# EAGLE design Board LineFollower V.2 (EAGLE 5.06)
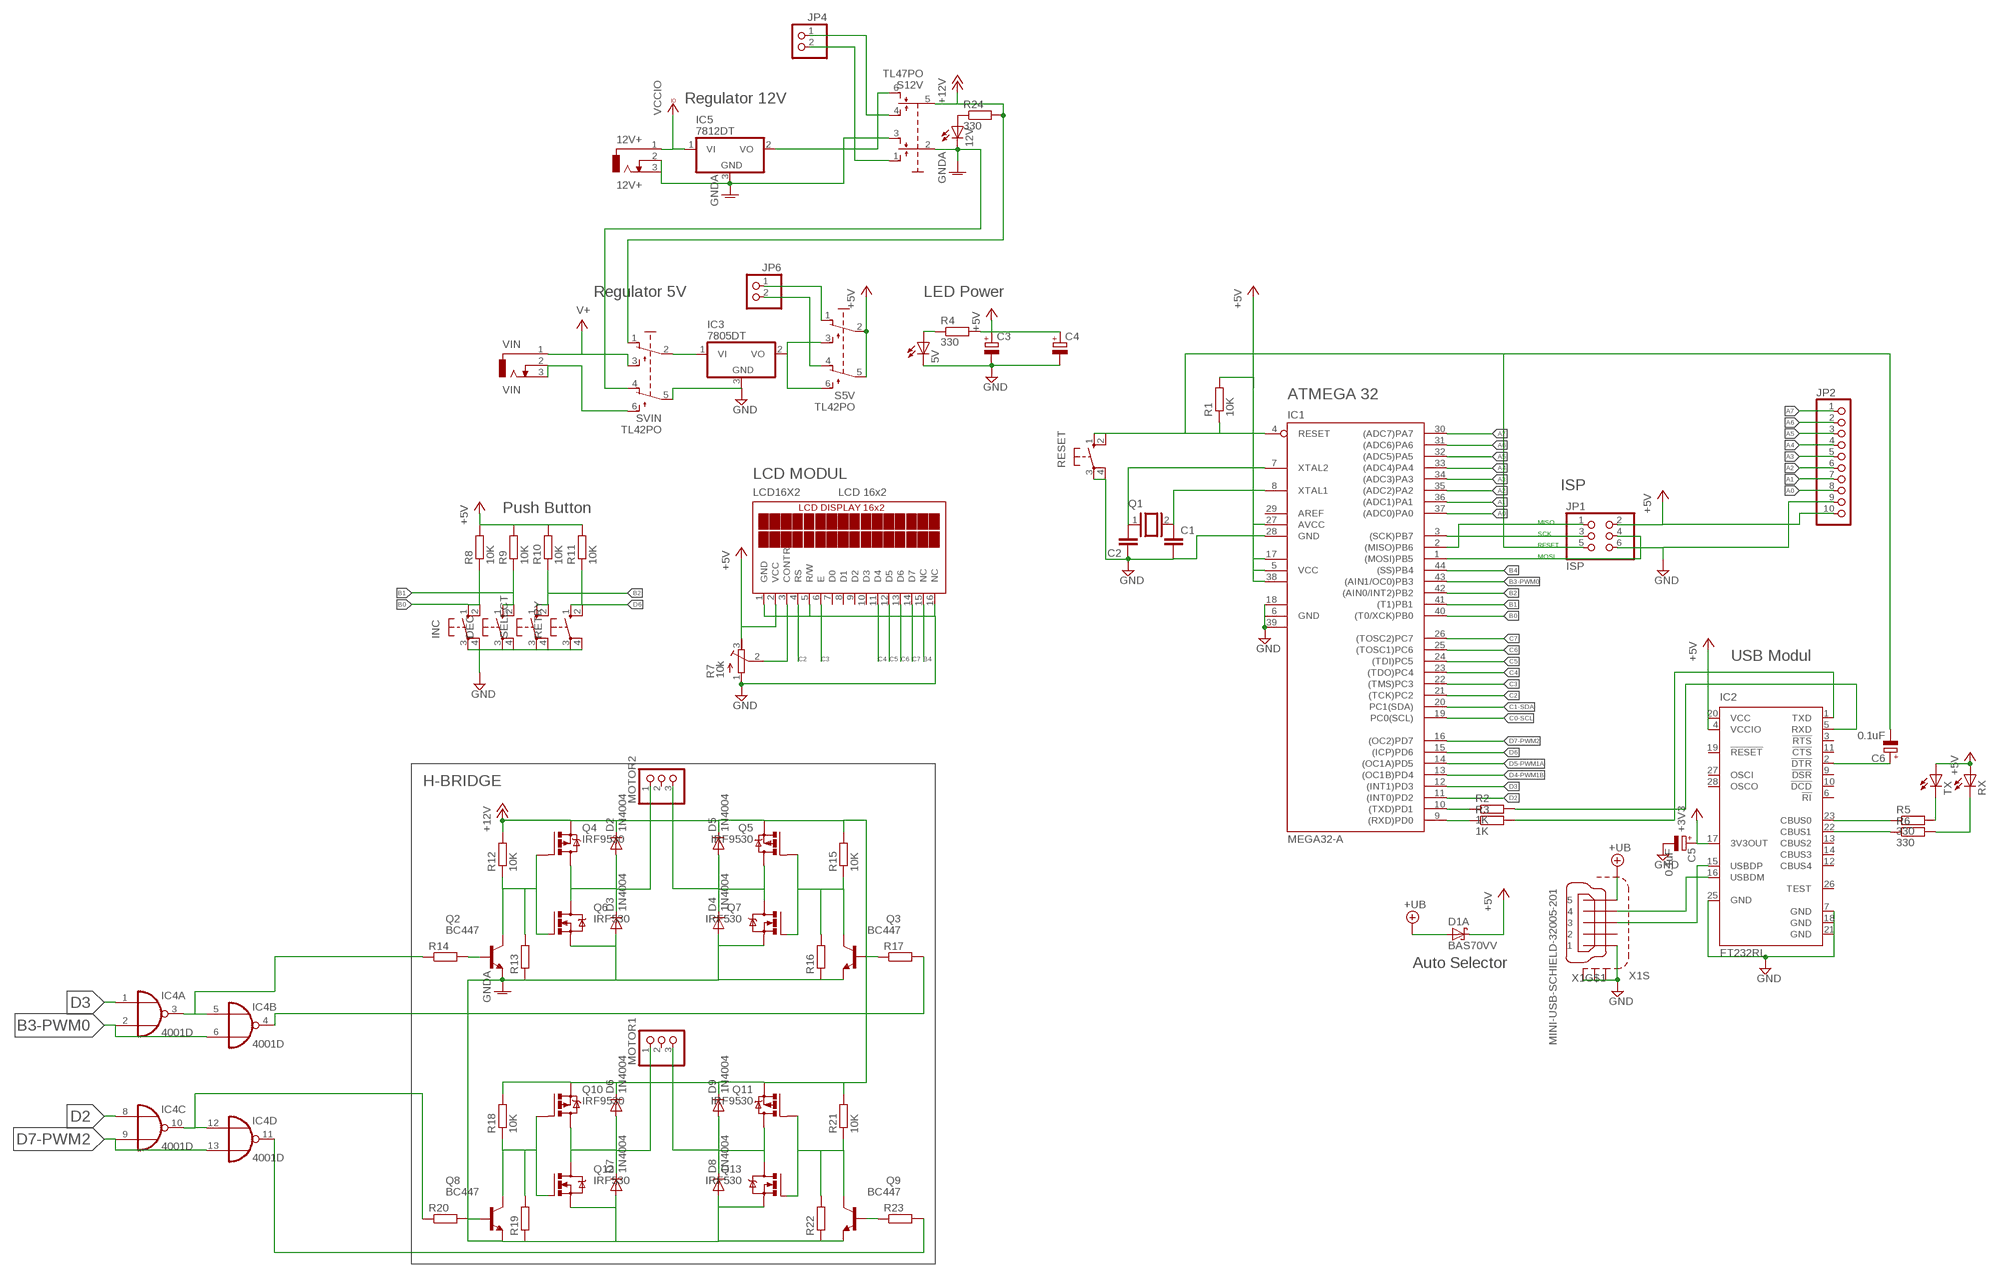
[diagram p0: schematic, sheet 1]

## Parts
5V  LED5MM  [LED5MM]
12V  LED5MM  [LED5MM]
12V+  12V+  DCJ0202  [DCJ0202]
C1  C-EU050-025X075  [C050-025X075]
C2  C-EU050-025X075  [C050-025X075]
C3  CPOL-EUE3.5-8  [E3,5-8]
C4  CPOL-EUE3.5-8  [E3,5-8]
C5  0.1uF  CPOL-EUE2-4  [E2-4]
C6  0.1uF  CPOL-EUE2-4  [E2-4]
D1  BAS70VV  [SOT666]
D2  1N4004  [DO41-10]
D3  1N4004  [DO41-10]
D4  1N4004  [DO41-10]
D5  1N4004  [DO41-10]
D6  1N4004  [DO41-10]
D7  1N4004  [DO41-10]
D8  1N4004  [DO41-10]
D9  1N4004  [DO41-10]
DEC  10-XX  [B3F-10XX]
IC1  MEGA32-A  [TQFP44]
IC2  FT232RL  [SSOP28]
IC3  7805DT  [TO252]
IC4  4001D  [SO14]
IC5  7812DT  [TO252]
INC  10-XX  [B3F-10XX]
JP1  ISP  PINHD-2X3  [2X03]
JP2  PINHD-1X10  [1X10]
JP4  PINHD-1X2  [1X02]
JP6  PINHD-1X2  [1X02]
LCD16X2  LCD 16x2  TUXGR_16X2_R2  [TUXGR_16X2_R2]
MOTOR1  PINHD-1X3  [1X03]
MOTOR2  PINHD-1X3  [1X03]
Q1  XTAL/S  [QS]
Q2  BC447  [TO92-EBC]
Q3  BC447  [TO92-EBC]
Q4  IRF9530  [TO220BV]
Q5  IRF9530  [TO220BV]
Q6  IRF530  [TO220BV]
Q7  IRF530  [TO220BV]
Q8  BC447  [TO92-EBC]
Q9  BC447  [TO92-EBC]
Q10  IRF9530  [TO220BV]
Q11  IRF9530  [TO220BV]
Q12  IRF530  [TO220BV]
Q13  IRF530  [TO220BV]
R1  10K  R-EU_0207/7  [0207/7]
R2  1K  R-EU_0207/7  [0207/7]
R3  1K  R-EU_0207/7  [0207/7]
R4  330  R-EU_0207/7  [0207/7]
R5  330  R-EU_0207/7  [0207/7]
R6  330  R-EU_0207/7  [0207/7]
R7  10k  R-TRIMM3339P  [RTRIM3339P]
R8  10K  R-EU_0207/7  [0207/7]
R9  10K  R-EU_0207/7  [0207/7]
R10  10K  R-EU_0207/7  [0207/7]
R11  10K  R-EU_0207/7  [0207/7]
R12  10K  R-EU_0207/7  [0207/7]
R13  R-EU_0207/7  [0207/7]
R14  R-EU_0207/7  [0207/7]
R15  10K  R-EU_0207/7  [0207/7]
R16  R-EU_0207/7  [0207/7]
R17  R-EU_0207/7  [0207/7]
R18  10K  R-EU_0207/7  [0207/7]
R19  R-EU_0207/7  [0207/7]
R20  R-EU_0207/7  [0207/7]
R21  10K  R-EU_0207/7  [0207/7]
R22  R-EU_0207/7  [0207/7]
R23  R-EU_0207/7  [0207/7]
R24  330  R-EU_0207/7  [0207/7]
RESET  10-XX  [B3F-10XX]
RETRY  10-XX  [B3F-10XX]
RX  LED5MM  [LED5MM]
S5V  TL42PO  [TL4XPO]
S12V  TL47PO  [TL4XPO]
SELECT  10-XX  [B3F-10XX]
SVIN  TL42PO  [TL4XPO]
TX  LED5MM  [LED5MM]
VIN  VIN  DCJ0202  [DCJ0202]
X1  MINI-USB-SCHIELD-32005-201  [32005-201]

## Nets
+3V3: C5.+ IC2.17(3V3OUT)
+5V: C3.+ C4.+ D1.6(A:C) IC1.5(VCC) IC1.17(VCC1) IC1.27(AVCC) IC1.38(VCC2) IC2.4(VCCIO) IC2.20(VCC) JP1.2 JP2.10 LCD16X2.2(VCC) R1.2 R4.2 R7.3(A) R8.2 R9.2 R10.2 R11.2 RX.A S5V.2(P) S5V.5(P1) TX.A
+12V: D2.C D5.C D6.C D9.C Q4.S Q5.S Q10.S Q11.S R12.2 R15.2 R18.2 R21.2 R24.2 S12V.5(P1) SVIN.1(O)
+UB: D1.1(A:A)
+USB: X1.5 ; supply symbol labelled +UB
A0: IC1.37((ADC0)PA0) JP2.8
A1: IC1.36((ADC1)PA1) JP2.7
A2: IC1.35((ADC2)PA2) JP2.6
A3: IC1.34((ADC3)PA3) JP2.5
A4: IC1.33((ADC4)PA4) JP2.4
A5: IC1.32((ADC5)PA5) JP2.3
A6: IC1.31((ADC6)PA6) JP2.2
A7: IC1.30((ADC7)PA7) JP2.1
B0: IC1.40((T0/XCK)PB0) INC.1(S) INC.2(S1) R8.1
B1: DEC.1(S) DEC.2(S1) IC1.41((T1)PB1) R9.1
B2: IC1.42((AIN0/INT2)PB2) R10.1 SELECT.1(S) SELECT.2(S1)
B3-PWM0: IC1.43((AIN1/OC0)PB3) IC4.2(A:I1) IC4.6(B:I1)
B4: IC1.44((SS)PB4) LCD16X2.15(NC)
B5-MOSI: IC1.1((MOSI)PB5) JP1.4
B6-MISO: IC1.2((MISO)PB6) JP1.1
B7-SCK: IC1.3((SCK)PB7) JP1.3
C0-SCL: IC1.19(PC0(SCL))
C1-SDA: IC1.20(PC1(SDA))
C2: IC1.21((TCK)PC2) LCD16X2.4(RS)
C3: IC1.22((TMS)PC3) LCD16X2.6(E)
C4: IC1.23((TDO)PC4) LCD16X2.11(D4)
C5: IC1.24((TDI)PC5) LCD16X2.12(D5)
C6: IC1.25((TOSC1)PC6) LCD16X2.13(D6)
C7: IC1.26((TOSC2)PC7) LCD16X2.14(D7)
D0-RX: IC1.9((RXD)PD0) R3.1
D1-TX: IC1.10((TXD)PD1) R2.1
D2: IC1.11((INT0)PD2) IC4.8(C:I0)
D3: IC1.12((INT1)PD3) IC4.1(A:I0)
D4-PWM1B: IC1.13((OC1B)PD4)
D5-PWM1A: IC1.14((OC1A)PD5)
D6: IC1.15((ICP)PD6) R11.1 RETRY.1(S) RETRY.2(S1)
D7-PWM2: IC1.16((OC2)PD7) IC4.9(C:I1) IC4.13(D:I1)
GND: 5V.K(C) C1.2 C2.1 C3.- C4.- C5.- DEC.3(P) DEC.4(P1) IC1.6(GND) IC1.18(GND1) IC1.28(GND) IC1.39(GND2) IC2.7(GND) IC2.18(GND) IC2.21(GND) IC2.25(GND) IC3.3(GND) INC.3(P) INC.4(P1) JP1.6 JP2.9 LCD16X2.1(GND) LCD16X2.5(R/W) LCD16X2.16(NC) R7.1(E) RESET.3(P) RESET.4(P1) RETRY.3(P) RETRY.4(P1) SELECT.3(P) SELECT.4(P1) SVIN.5(P1) X1.1 X1.M1(S:S1) X1.M2(S:S2) X1.M3(S:S3) X1.M4(S:S4)
GNDA: 12V+.2 12V+.3 12V.K(C) D3.A D4.A D7.A D8.A IC5.3(GND) Q2.E Q3.E Q6.S Q7.S Q8.E Q9.E Q12.S Q13.S R13.1 R16.1 R19.1 R22.1 S12V.2(P) S12V.3(S) SVIN.4(O1)
MOTOR1A: D2.A D3.C MOTOR2.1 Q4.D Q6.D
MOTOR1A1: D6.A D7.C MOTOR1.1 Q10.D Q12.D
MOTOR1B: D4.C D5.A MOTOR2.3 Q5.D Q7.D
MOTOR1B1: D8.C D9.A MOTOR1.3 Q11.D Q13.D
N$1: C2.2 IC1.7(XTAL2) Q1.1
N$2: C1.1 IC1.8(XTAL1) Q1.2
N$3: IC2.23(CBUS0) R5.1
N$4: IC2.22(CBUS1) R6.1
N$5: R5.2 TX.K(C)
N$6: 5V.A R4.1
N$7: R6.2 RX.K(C)
N$8: C6.+ IC2.2(!DTR)
N$9: IC2.16(USBDM) X1.4
N$10: IC2.15(USBDP) X1.3
N$11: Q8.C Q10.G Q12.G R18.1 R19.2
N$12: Q9.C Q11.G Q13.G R21.1 R22.2
N$13: LCD16X2.3(CONTR) R7.2(S)
N$14: Q9.B R23.1
N$15: Q8.B R20.2
N$16: Q2.C Q4.G Q6.G R12.1 R13.2
N$17: Q3.C Q5.G Q7.G R15.1 R16.2
N$18: IC4.3(A:O) IC4.5(B:I0) R14.1
N$19: IC4.10(C:O) IC4.12(D:I0) R20.1
N$20: IC4.4(B:O) R17.2
N$21: JP6.1 S5V.1(O)
N$22: IC4.11(D:O) R23.2
N$23: IC5.2(VO) S12V.6(S1)
N$24: Q3.B R17.1
N$25: Q2.B R14.2
N$26: IC3.2(VO) S5V.3(S) S5V.6(S1)
N$27: JP6.2 S5V.4(O1)
N$28: SVIN.6(S1) VIN.2 VIN.3
N$29: JP4.1 S12V.4(O1)
N$30: JP4.2 S12V.1(O)
N$31: IC3.1(VI) SVIN.2(P)
N$32: 12V.A R24.1
RESET: C6.- IC1.4(RESET) JP1.5 R1.1 RESET.1(S) RESET.2(S1)
RX: IC2.1(TXD) R3.2
TX: IC2.5(RXD) R2.2
V+: SVIN.3(S) VIN.1
VCCIO: 12V+.1 IC5.1(VI)
Unconnected: D1.2(B:A) D1.3(C:A) D1.4(C:C) D1.5(B:C) IC1.29(AREF) IC2.3(!RTS) IC2.6(!RI) IC2.9(!DSR) IC2.10(!DCD) IC2.11(!CTS) IC2.12(CBUS4) IC2.13(CBUS2) IC2.14(CBUS3) IC2.19(!RESET) IC2.26(TEST) IC2.27(OSCI) IC2.28(OSCO) LCD16X2.7(D0) LCD16X2.8(D1) LCD16X2.9(D2) LCD16X2.10(D3) MOTOR1.2 MOTOR2.2 X1.2

## Notes on the sheet
- Regulator 12V
- Regulator 5V | LED Power
- ATMEGA 32
- LCD MODUL
- ISP
- Push Button
- MISO
- SCK
- RESET
- MOSI
- USB Modul
- H-BRIDGE
- Auto Selector

## Power pins joined to a net without a drawn wire
VDD: IC4.14(P:VDD)
VSS: IC4.7(P:VSS)

## Library data of the parts
5V 12V RX TX = led:LED: LED OSRAM: - CHIPLED LG R971, LG N971, LY N971, LG Q971, LY Q971, LO R971, LY R971 LH N974, LH R974 LS Q976, LO Q976, LY Q976 LO Q996 - Hyper CHIPLED LW Q18S LB Q993, LB Q99A, LB R99A - SideLED LS A670, LO A670, LY A670, LG A670, LP A670 LB A673, LV A673, LT A673, LW A673 LH A674 LY A675 LS A676, LA A676, LO A676, LY A676, LW A676 LS A679, LY A679, LG A679 - Hyper Micro SIDELED® LS Y876, LA Y876, LO Y876, LY Y876 LT Y87S - SmartLED LW L88C, LW L88S LB L89C, LB L89S, LG L890 LS L89K, LO L89K, LY L89K LS L896, LA L896, LO L896, LY L896 - TOPLED LS T670, LO T670, LY T670, LG T670, LP T670 LSG T670, LSP T670, LSY T670, LOP T670, LYG T670 LG T671, LOG T671, LSG T671 LB T673, LV T673, LT T673, LW T673 LH T674 LS T676, LA T676, LO T676, LY T676, LB T676, LH T676, LSB T676, LW T676 LB T67C, LV T67C, LT T67C, LS T67K, LO T67K, LY T67K, LW E67C LS E67B, LA E67B, LO E67B, LY E67B, LB E67C, LV E67C, LT E67C LW T67C LS T679, LY T679, LG T679 LS T770, LO T770, LY T770, LG T770, LP T770 LB T773, LV T773, LT T773, LW T773 LH T774 LS E675, LA E675, LY E675, LS T675 LS T776, LA T776, LO T776, LY T776, LB T776 LHGB T686 LT T68C, LB T68C - Hyper Mini TOPLED® LB M676 - Mini TOPLED Santana® LG M470 LS M47K, LO M47K, LY M47K Source: http://www.osram.convergy.de LUXEON: - LUMILED® LXK2-PW12-R00, LXK2-PW12-S00, LXK2-PW14-U00, LXK2-PW14-V00 LXK2-PM12-R00, LXK2-PM12-S00, LXK2-PM14-U00 LXK2-PE12-Q00, LXK2-PE12-R00, LXK2-PE12-S00, LXK2-PE14-T00, LXK2-PE14-U00 LXK2-PB12-K00, LXK2-PB12-L00, LXK2-PB12-M00, LXK2-PB14-N00, LXK2-PB14-P00, LXK2-PB14-Q00 LXK2-PR12-L00, LXK2-PR12-M00, LXK2-PR14-Q00, LXK2-PR14-R00 LXK2-PD12-Q00, LXK2-PD12-R00, LXK2-PD12-S00 LXK2-PH12-R00, LXK2-PH12-S00 LXK2-PL12-P00, LXK2-PL12-Q00, LXK2-PL12-R00 Source: www.luxeon.com KINGBRIGHT: KA-3528ASYC Source: www.kingbright.com
12V+ VIN = con-jack:DCJ0202: DC POWER JACK Source: DCJ0202.pdf
C1 C2 = resistor:C-EU: CAPACITOR, European symbol
C3-C6 = resistor:CPOL-EU: POLARIZED CAPACITOR, European symbol
D1 = diode:BAS70VV: Silicon Schottky Diodes General-purpose diode for high-speed switching Source: BAS70_1PS7XSB70_SER_8.pdf
D2-D9 = diode:1N4004: DIODE general purpose rectifier, 1 A
DEC INC RESET RETRY SELECT = switch-omron:10-XX: OMRON SWITCH
IC1 = atmel:MEGA32: MICROCONTROLLER 32 Kbytes FLASH 2 Kbytes SRAM 1 Kbytes EEPROM USART 8-channel 10 bit ADC Source: www.atmel.com .. doc2503.pdf
IC2 = ftdichip:FT232R: Source: http://www.ftdichip.com/Documents/DataSheets/DS_FT232R_v104.pdf
IC3 IC5 = linear:78*: Positive VOLTAGE REGULATOR Source: http://cache.national.com/ds/LM/LM78L05.pdf http://www.fairchildsemi.com/ds/LM/LM7805.pdf
IC4 = 40xx:4001: Quad 2-input NOR
JP1 = pinhead:PINHD-2X3: PIN HEADER
JP2 = pinhead:PINHD-1X10: PIN HEADER
JP4 JP6 = pinhead:PINHD-1X2: PIN HEADER
LCD16X2 = display-lcd:TUXGR_16X2_R2: Tuxgraphics LCD display 16x2 characters reflective, without background light Source: tuxgr_12x2_r2.pdf
MOTOR1 MOTOR2 = pinhead:PINHD-1X3: PIN HEADER
Q1 = special:XTAL/S: CRYSTAL
Q2 Q3 Q8 Q9 = transistor-npn:BC447*: NPN Transistor
Q4 Q5 Q10 Q11 = transistor-power:IRF9530: P-CHANNEL HEXFET POWER-MOS-FET Source: http://www.irf.com/product-info/datasheets/data/irf9530.pdf
Q6 Q7 Q12 Q13 = transistor-power:IRF530: HEXFET Power MOSFET
R1-R6 R8-R24 = resistor:R-EU_: RESISTOR, European symbol
R7 = resistor:R-TRIMM: Trimm resistor
S5V SVIN = switch:TL42PO: TINY SWITCH ON - MOM Source: http://www2.produktinfo.conrad.com/datenblaetter/700000-724999/705152-da-01-de-Subminiaturschalter_TL_36YO.pdf
S12V = switch:TL47PO: TINY SWITCH MOM OFF MOM Source: http://www2.produktinfo.conrad.com/datenblaetter/700000-724999/705152-da-01-de-Subminiaturschalter_TL_36YO.pdf
X1 = con-cypressindustries:MINI-USB-SCHIELD-: MINI USB-B Conector Source: www.cypressindustries.com

## Board
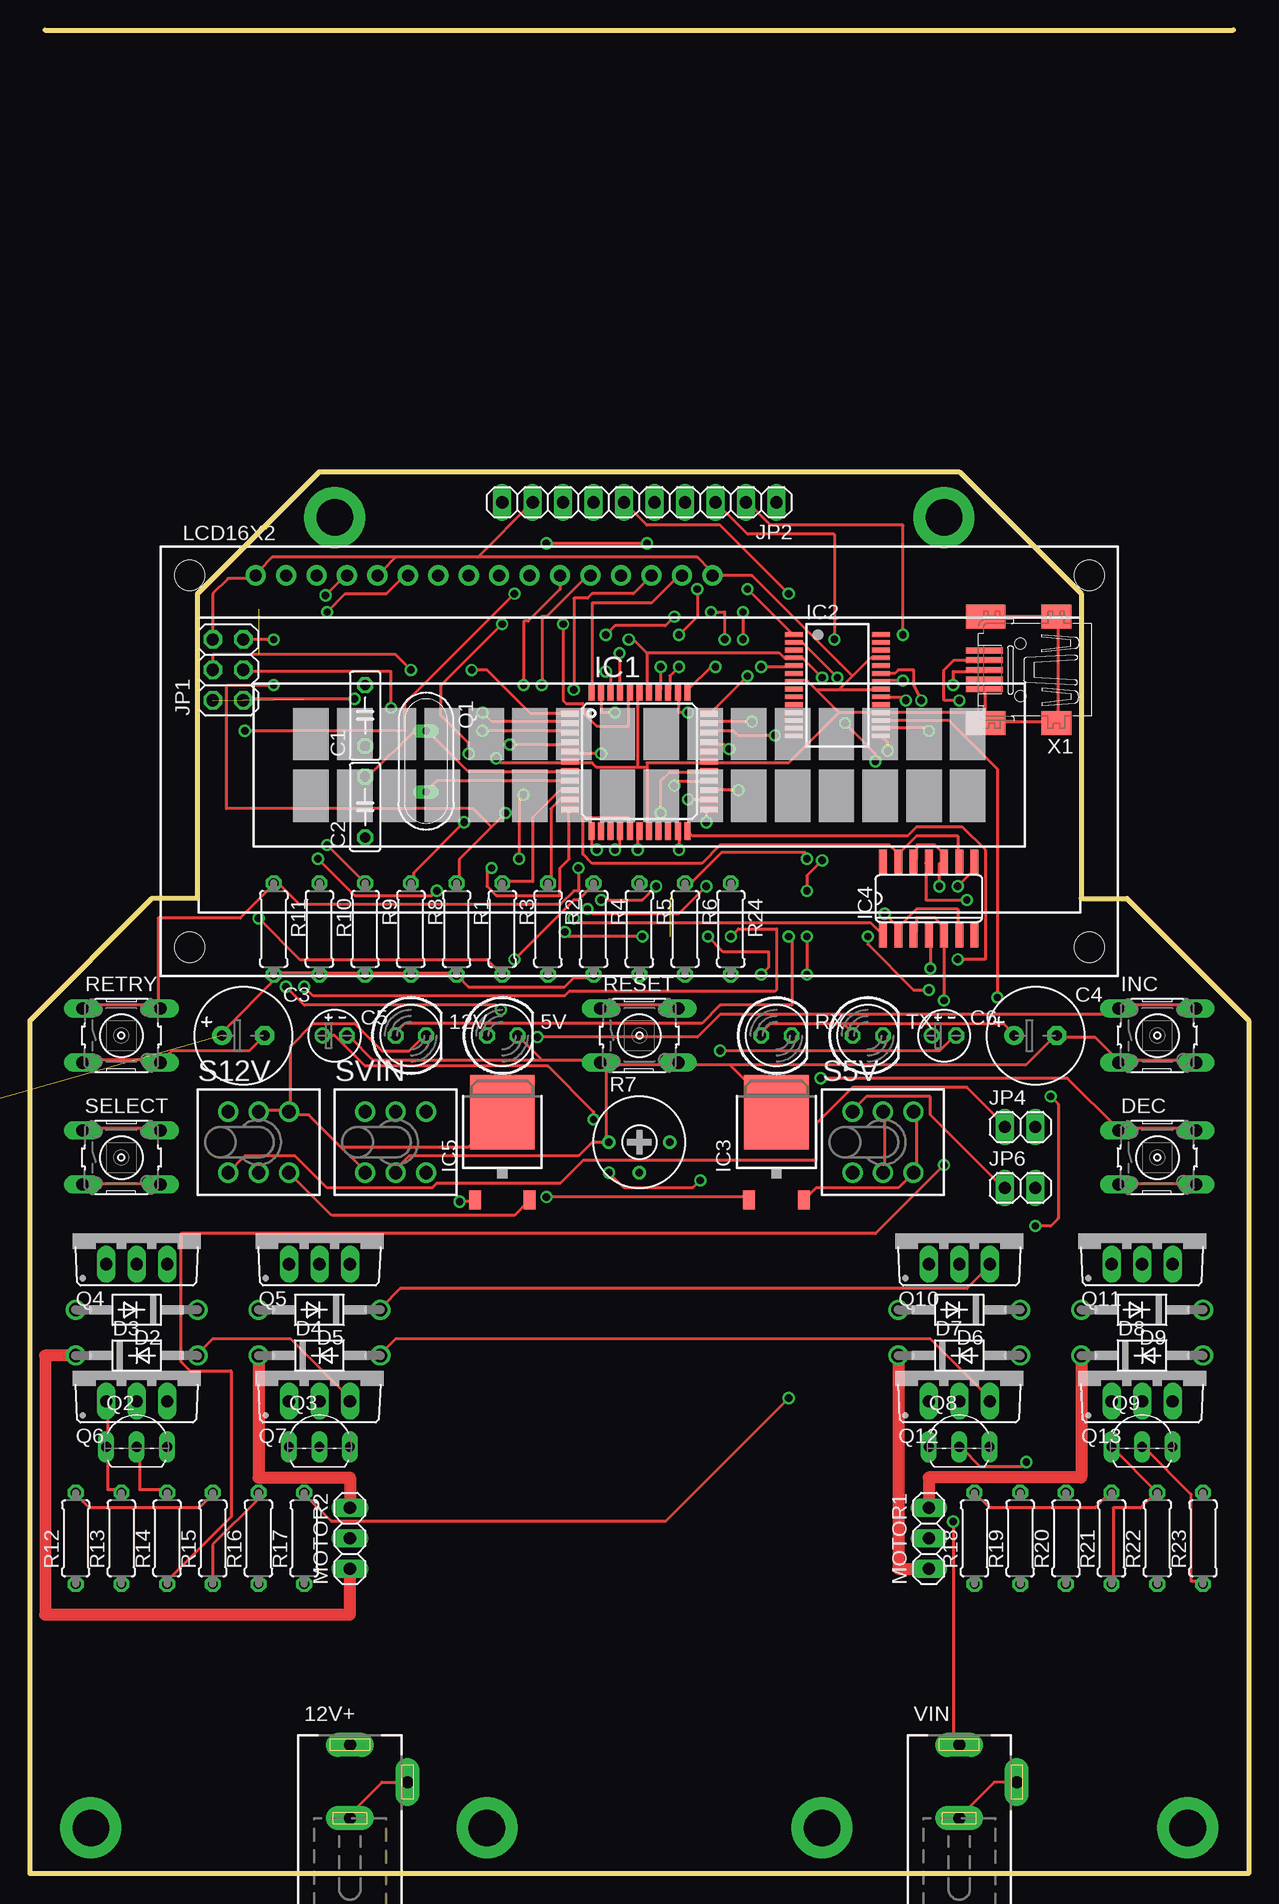
[diagram p1: board, top side]
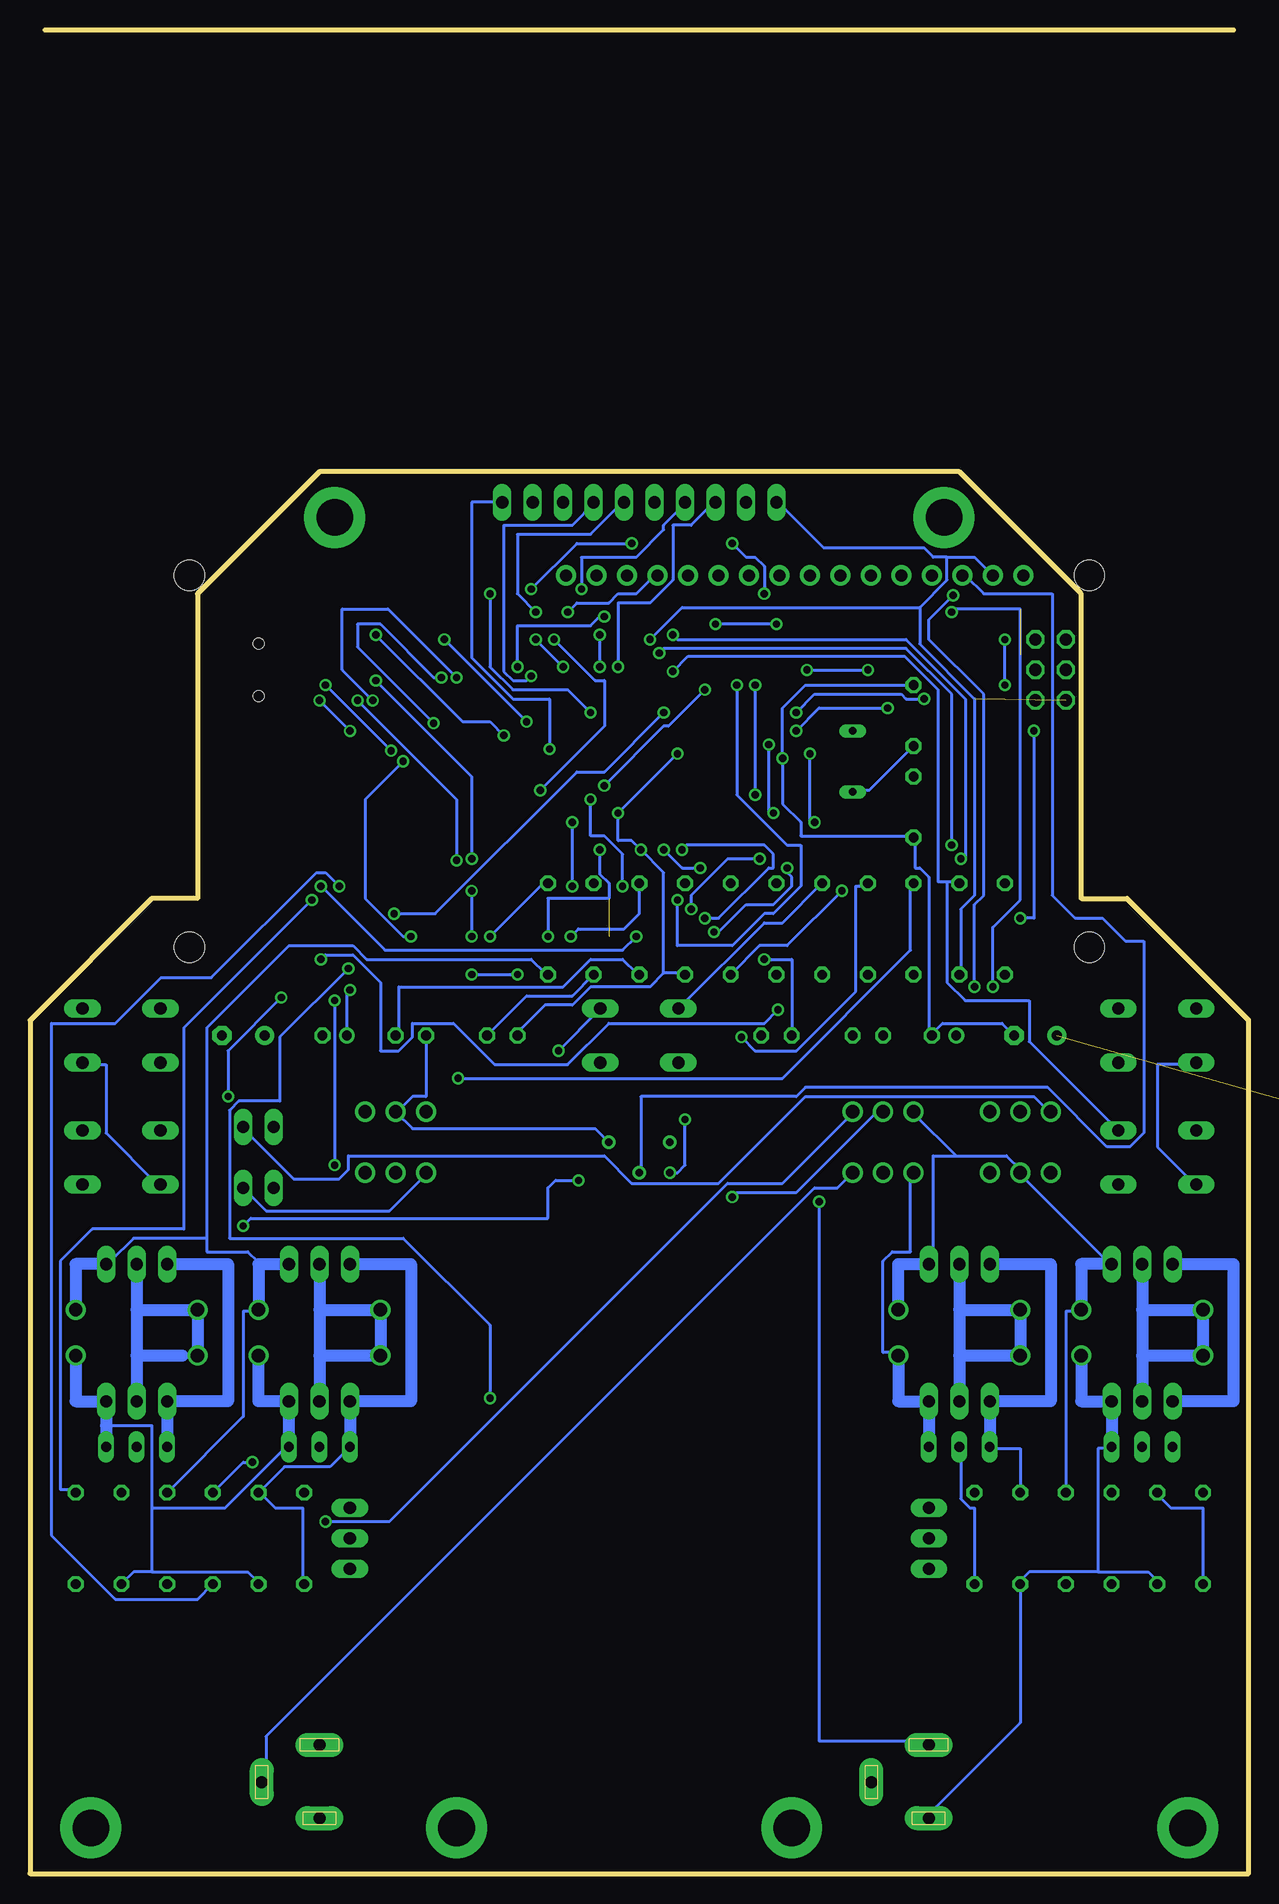
[diagram p2: board, bottom side, seen from below]

Size 101.6 x 153.67 mm. Coordinates in mm from the lower left corner, seen from the top.
Outline: 1.27,153.67 100.33,153.67
Outline: 101.6,71.12 101.6,0 0,0 0,71.12 10.16,81.28 13.97,81.28 13.97,106.68 24.13,116.84 77.47,116.84 87.63,106.68 87.63,81.28 91.44,81.28 101.6,71.12
Copper layers (1*16): Top 0.035mm / dielectric 1.5mm / Bottom 0.035mm
Design rules "default": minimum track width 10mil, minimum drill 24mil, track to track 8mil, track to pad 8mil, pad to pad 8mil, via to via 8mil, smd to smd 8mil, copper to edge 40mil, drill to drill 8mil, minimum pad ring 10mil, minimum via ring 8mil, stop-mask expansion 4mil, vias tented up to drill 0mil, thermal gap 10mil

### Footprints (pad centres in the part's own frame; a part is rotated, then mirrored left to right if it is on the bottom)
LED5MM = drill 0.813 octagon: A -1.27,0; K 1.27,0
DCJ0202 = drill 1 pad 2 long: 1 0,3.1; 2 4.8,0; 3 0,-3
C050-025X075 = drill 0.813 octagon: 1 -2.54,0; 2 2.54,0
E3,5-8 = drill 0.813 pad 1.6 round: + -1.778,0 | drill 0.813 pad 1.6 octagon: - 1.778,0
E2-4 = drill 0.813 pad 1.27 round: + -1.016,0 | drill 0.813 pad 1.27 octagon: - 1.016,0
SOT666 = smd 0.375 x 0.5: 1 -0.537,-0.85; 3 0.538,-0.85; 4 0.538,0.849; 6 -0.538,0.85 | smd 0.3 x 0.65: 2 0,-0.923; 5 0,0.925
DO41-10 = drill 1.118 round: A 5.08,0; C -5.08,0
B3F-10XX = drill 1.016 long: 1 -3.251,2.261; 2 3.251,2.261; 3 -3.251,-2.261; 4 3.251,-2.261
TQFP44 = smd 1.5 x 0.5: 1 -5.8,4; 2 -5.8,3.2; 3 -5.8,2.4; 4 -5.8,1.6; 5 -5.8,0.8; 6 -5.8,0; 7 -5.8,-0.8; 8 -5.8,-1.6; 9 -5.8,-2.4; 10 -5.8,-3.2; 11 -5.8,-4; 23 5.8,-4; 24 5.8,-3.2; 25 5.8,-2.4; 26 5.8,-1.6; 27 5.8,-0.8; 28 5.8,0; 29 5.8,0.8; 30 5.8,1.6; 31 5.8,2.4; 32 5.8,3.2; 33 5.8,4 | smd 0.5 x 1.5: 12 -4,-5.8; 13 -3.2,-5.8; 14 -2.4,-5.8; 15 -1.6,-5.8; 16 -0.8,-5.8; 17 0,-5.8; 18 0.8,-5.8; 19 1.6,-5.8; 20 2.4,-5.8; 21 3.2,-5.8; 22 4,-5.8; 34 4,5.8; 35 3.2,5.8; 36 2.4,5.8; 37 1.6,5.8; 38 0.8,5.8; 39 0,5.8; 40 -0.8,5.8; 41 -1.6,5.8; 42 -2.4,5.8; 43 -3.2,5.8; 44 -4,5.8
SSOP28 = smd 0.4 x 1.5: 1 -4.225,-3.625; 2 -3.575,-3.625; 3 -2.925,-3.625; 4 -2.275,-3.625; 5 -1.625,-3.625; 6 -0.975,-3.625; 7 -0.325,-3.625; 8 0.325,-3.625; 9 0.975,-3.625; 10 1.625,-3.625; 11 2.275,-3.625; 12 2.925,-3.625; 13 3.575,-3.625; 14 4.225,-3.625; 15 4.225,3.625; 16 3.575,3.625; 17 2.925,3.625; 18 2.275,3.625; 19 1.625,3.625; 20 0.975,3.625; 21 0.325,3.625; 22 -0.325,3.625; 23 -0.975,3.625; 24 -1.625,3.625; 25 -2.275,3.625; 26 -2.925,3.625; 27 -3.575,3.625; 28 -4.225,3.625
TO252 = smd 1 x 1.6: 1 -2.28,-4.8; 2 2.28,-4.8 | smd 5.4 x 6.2: 3 0,2.5
SO14 = smd 0.66 x 2.032: 1 -3.81,-3.073; 2 -2.54,-3.073; 3 -1.27,-3.073; 4 0,-3.073; 5 1.27,-3.073; 6 2.54,-3.073; 7 3.81,-3.073; 8 3.81,3.073; 9 2.54,3.073; 10 1.27,3.073; 11 0,3.073; 12 -1.27,3.073; 13 -2.54,3.073; 14 -3.81,3.073
2X03 = drill 1.016 octagon: 1 -2.54,-1.27; 2 -2.54,1.27; 3 0,-1.27; 4 0,1.27; 5 2.54,-1.27; 6 2.54,1.27
1X10 = drill 1.016 long: 1 -11.43,0; 2 -8.89,0; 3 -6.35,0; 4 -3.81,0; 5 -1.27,0; 6 1.27,0; 7 3.81,0; 8 6.35,0; 9 8.89,0; 10 11.43,0
1X02 = drill 1.016 long: 1 -1.27,0; 2 1.27,0
TUXGR_16X2_R2 = drill 1 pad 1.676 round: 1 -32,15.5; 2 -29.46,15.5; 3 -26.92,15.5; 4 -24.38,15.5; 5 -21.84,15.5; 6 -19.3,15.5; 7 -16.76,15.5; 8 -14.22,15.5; 9 -11.68,15.5; 10 -9.14,15.5; 11 -6.6,15.5; 12 -4.06,15.5; 13 -1.52,15.5; 14 1.02,15.5; 15 3.56,15.5; 16 6.1,15.5 | hole 2.5: -37.5,-15.5; 37.5,-15.5; -37.5,15.5; 37.5,15.5
1X03 = drill 1.016 long: 1 -2.54,0; 2 0,0; 3 2.54,0
QS = drill 0.61 long: 1 -2.54,0; 2 2.54,0
TO92-EBC = drill 0.813 long: B 0,-1.27; C -2.54,-1.27; E 2.54,-1.27
TO220BV = drill 1.016 long: D 0,-2.54; G -2.54,-2.54; S 2.54,-2.54
0207/7 = drill 0.813 octagon: 1 -3.81,0; 2 3.81,0
RTRIM3339P = drill 0.61 round: 1 -2.54,0; 2 0,-2.54; 3 2.54,0
TL4XPO = drill 1.1 pad 1.676 round: 1 -2.54,2.54; 2 0,2.54; 3 2.54,2.54; 4 -2.54,-2.54; 5 0,-2.54; 6 2.54,-2.54
32005-201 = smd 3.1 x 0.5: 1 3,1.6; 2 3,0.8; 3 3,0; 4 3,-0.8; 5 3,-1.6 | smd 2.5 x 2: M1 -3,-4.45; M2 -3,4.45 | smd 3.3 x 2: M3 2.9,4.45; M4 2.9,-4.45 | hole 0.9: 0,2.2; 0,-2.2

### Placement (x,y rotation side)
5V  39.37,69.85 0 top
12V  31.75,69.85 0 top
12V+  26.67,7.62 0 top
C1  27.94,96.52 90 top
C2  27.94,88.9 90 top
C3  17.78,69.85 0 top
C4  83.82,69.85 0 top
C5  25.4,69.85 0 top
C6  76.2,69.85 0 top
D1  -43.18,52.07 0 top  (outside the outline)
D2  8.89,46.99 180 top
D3  8.89,43.18 0 top
D4  24.13,43.18 0 top
D5  24.13,46.99 180 top
D6  77.47,46.99 180 top
D7  77.47,43.18 0 top
D8  92.71,43.18 0 top
D9  92.71,46.99 180 top
DEC  93.98,59.69 0 top
IC1  50.8,92.71 0 top
IC2  67.31,99.06 270 top
IC3  62.23,60.96 0 top
IC4  74.93,81.28 0 top
IC5  39.37,60.96 0 top
INC  93.98,69.85 0 top
JP1  16.51,100.33 90 top
JP2  50.8,114.3 180 top
JP4  82.55,62.23 0 top
JP6  82.55,57.15 0 top
LCD16X2  50.8,92.71 0 top
MOTOR1  74.93,27.94 90 top
MOTOR2  26.67,27.94 90 top
Q1  33.02,92.71 270 top
Q2  8.89,36.83 0 top
Q3  24.13,36.83 0 top
Q4  8.89,53.34 0 top
Q5  24.13,53.34 0 top
Q6  8.89,41.91 0 top
Q7  24.13,41.91 0 top
Q8  77.47,36.83 0 top
Q9  92.71,36.83 0 top
Q10  77.47,53.34 0 top
Q11  92.71,53.34 0 top
Q12  77.47,41.91 0 top
Q13  92.71,41.91 0 top
R1  35.56,78.74 270 top
R2  43.18,78.74 270 top
R3  39.37,78.74 270 top
R4  46.99,78.74 270 top
R5  50.8,78.74 270 top
R6  54.61,78.74 270 top
R7  50.8,60.96 0 top
R8  31.75,78.74 270 top
R9  27.94,78.74 270 top
R10  24.13,78.74 270 top
R11  20.32,78.74 270 top
R12  3.81,27.94 90 top
R13  7.62,27.94 90 top
R14  11.43,27.94 90 top
R15  15.24,27.94 90 top
R16  19.05,27.94 90 top
R17  22.86,27.94 90 top
R18  78.74,27.94 90 top
R19  82.55,27.94 90 top
R20  86.36,27.94 90 top
R21  90.17,27.94 90 top
R22  93.98,27.94 90 top
R23  97.79,27.94 90 top
R24  58.42,78.74 270 top
RESET  50.8,69.85 0 top
RETRY  7.62,69.85 0 top
RX  62.23,69.85 0 top
S5V  71.12,60.96 0 top
S12V  19.05,60.96 0 top
SELECT  7.62,59.69 0 top
SVIN  30.48,60.96 0 top
TX  69.85,69.85 0 top
VIN  77.47,7.62 0 top
X1  82.55,100.33 180 top

### Tracks (layer width: path | path; a pad name or v marks a point on that pad's centre or on a via)
+3V3  (via drill 0.6 pad 0.3)
  Top 0.254: C5.+ 25.4,69.85 27.94,67.31 43.18,67.31 46.99,63.5 v46.99,62.86 | v48.26,58.42 49.53,57.15 55.25,57.15 v55.88,57.78 | v83.82,53.97 85.09,53.97 85.72,54.61 85.72,64.13 v85.09,64.77 | v80.64,73.02 80.64,92.07 76.58,96.13 IC2.17
  Bottom 0.254: v46.99,62.86 46.99,59.05 47.62,58.42 v48.26,58.42 | v55.88,57.78 57.79,57.78 58.42,57.15 58.42,54.61 83.19,54.61 v83.82,53.97 | v85.09,64.77 85.09,68.58 v80.64,73.02
+5V  (via drill 0.6 pad 0.3, 0.61)  (2 unrouted)
  Top 0.254: 51.44,101.73 51.44,98.68 IC1.38 | 51.44,101.73 62.48,101.73 62.87,101.35 63.63,101.35 IC2.4 64.4,101.33 v66.04,99.69 | 51.44,101.73 50.29,102.87 v49.91,102.87 | 67.82,70.87 61.72,70.87 60.96,70.1 RX.A | 67.82,70.87 68.58,70.1 TX.A | 67.82,70.87 81.15,70.87 81.91,70.1 C4.+ | S5V.5 71.25,58.67 71.25,63.25 S5V.2 | C3.+ 16,70.1 20.57,74.68 R11.2 20.57,75.06 24,75.06 R10.2 24.38,75.06 27.81,75.06 R9.2 28.19,75.06 31.62,75.06 R8.2 32,75.06 35.43,75.06 R1.2 36.58,73.91 44.58,73.91 45.34,74.68 46.86,74.68 R4.2 | v50.67,85.34 50.67,86.87 IC1.17 | v52.58,88.39 52.58,91.06 53.34,91.82 56.39,91.82 IC1.27 | v47.62,93.34 45.34,93.34 IC1.5 | IC2.20 72.73,98.08 v73.02,97.79
  Bottom 0.254: 25.15,109.73 22.86,109.73 21.72,108.58 LCD16X2.2 | 25.15,109.73 26.29,109.73 27.05,110.49 35.43,110.49 39.24,114.3 JP2.10 | v49.91,102.87 47.24,105.54 27.43,105.54 | 27.43,105.54 25.15,107.82 25.15,109.73 | R7.3 54.48,62.1 69.72,62.1 S5V.2 70.87,63.63 69.72,64.77 68.58,64.77 TX.A | 48.77,75.06 48.77,83.44 v50.67,85.34 51.44,86.11 52.58,86.11 v52.58,88.39 v47.62,93.34 | 48.77,75.06 47.24,75.06 R4.2 | 48.77,75.06 49.91,73.91 54.86,73.91 56.39,72.39 58.67,72.39 60.96,70.1 RX.A | 27.43,105.54 27.43,102.49 22.86,97.92 22.86,81.53 24,80.39 24,75.06 R10.2 | v66.04,99.69 71.75,105.41 75.56,105.41 75.56,100.33 v73.02,97.79
+12V
  Top 0.254: R12.2 3.81,31.62 4.95,30.48 14.1,30.48 15.24,31.62 R15.2 | R18.2 80.01,30.48 88.77,30.48 89.92,31.62 R21.2 | D5.C 29.34,47.24 30.86,48.77 78.1,48.77 80.01,50.67 Q10.S
  Bottom 0.254: Q4.S 11.81,51.05 19.05,58.29 S12V.5 19.05,58.67 20.19,59.82 24.38,59.82 | 24.38,59.82 27.81,63.25 SVIN.1 | 24.38,59.82 26.29,59.82 26.29,51.05 Q5.S | R15.2 15.24,46.86 14.1,46.86 D2.C | 86.87,52.96 86.87,51.82 83.44,51.82 82.68,51.05 82.55,50.8 | 86.87,52.96 86.87,70.48 80.01,77.34 74.68,77.34 73.53,76.2 59.82,76.2 58.67,75.06 R24.2 | 86.87,52.96 92.96,52.96 94.87,51.05 Q11.S | R21.2 83.82,38.1 83.82,46.86 82.68,46.86 D6.C
  Bottom 1.016: Q11.S 97.79,50.8 D9.C | Q10.S 82.55,50.8 D6.C | Q5.S 29.21,50.8 D5.C | Q4.S 13.97,50.8 D2.C
A0  (via drill 0.61)
  Top 0.254: v52.58,100.58 52.58,98.68 IC1.37
  Bottom 0.254: v52.58,100.58 52.58,105.92 49.91,105.92 48.01,107.82 48.01,112.39 46.48,112.39 44.58,114.3 JP2.8
A1  (via drill 0.61)
  Top 0.254: v54.1,100.58 53.34,99.82 53.34,98.68 IC1.36 | v54.1,103.25 55.63,104.77 v55.63,107.06
  Bottom 0.254: v54.1,103.25 v54.1,100.58 | v55.63,107.06 55.63,109.73 51.05,109.73 48.77,112.01 48.77,112.39 46.86,114.3 JP2.7
A2  (via drill 0.61)
  Top 0.254: v54.86,96.77 54.1,96.77 54.1,98.3 IC1.35 | v63.25,106.68 57.53,112.39 51.44,112.39 JP2.6
  Bottom 0.254: v54.86,96.77 56.77,98.68 61.34,98.68 63.25,100.58 v63.25,106.68
A3  (via drill 0.61)
  Top 0.254: v57.15,100.58 56.77,100.58 54.86,98.68 IC1.34 | v59.44,105.16 v59.44,102.87
  Bottom 0.254: v59.44,102.87 v57.15,100.58 | v59.44,105.16 60.96,106.68 60.96,111.63 54.86,111.63 52.2,114.3 JP2.5
A4  (via drill 0.61)
  Top 0.254: v59.82,99.82 56.77,96.77 IC1.33
  Bottom 0.254: v59.82,99.82 60.2,99.44 61.34,99.44 62.1,100.2 62.1,112.39 56.39,112.39 54.48,114.3 JP2.4
A5  (via drill 0.61)
  Top 0.254: v60.2,96.01 56.77,96.01 IC1.32 | v67.06,102.87 67.06,111.63 59.82,111.63 JP2.3
  Bottom 0.254: v67.06,102.87 v60.2,96.01
A6  (via drill 0.61)
  Top 0.254: v62.1,94.87 59.05,94.87 58.67,95.25 56.77,95.25 IC1.31 | v72.77,103.25 72.77,112.39 61.72,112.39 59.82,114.3 JP2.2
  Bottom 0.254: v62.1,94.87 63.25,96.01 65.53,96.01 v72.77,103.25
A7  (via drill 0.61)
  Top 0.254: v58.29,93.73 57.91,94.11 56.77,94.11 IC1.30
  Bottom 0.254: v58.29,93.73 58.29,97.92 61.34,97.92 64.77,101.35 64.77,114.3 JP2.1
B0  (via drill 0.6, 0.61)
  Top 0.254: INC.2 97.16,72.39 91.06,72.39 INC.1 90.68,72.01 90.3,71.63 57.53,71.63 55.63,69.72 v42.29,69.72 | v36.2,87.63 32,83.44 32,82.68 R8.1 | IC1.40 49.91,98.3 49.91,95.63 47.24,95.63 46.1,96.77 46.1,97.54 44.7,97.54 44.45,97.79 v44.45,104.14 | v36.58,93.34 36.58,94.23 34.29,96.52 34.29,99.06 v39.37,104.14
  Bottom 0.254: v36.58,93.34 36.58,87.63 v36.2,87.63 | v42.29,69.72 41.15,68.58 37.72,68.58 32.77,73.53 32.77,82.3 32,82.3 R8.1 | v39.37,104.14 v44.45,104.14
B1  (via drill 0.61)
  Top 0.254: DEC.2 97.16,62.1 91.06,62.1 DEC.1 90.68,62.1 86.49,66.29 v65.91,66.29 | v49.15,101.73 49.15,98.68 IC1.41 | R9.1 v24.76,85.72
  Bottom 0.254: v49.15,101.73 48.77,102.11 28.57,102.11 24.76,98.3 v24.76,85.72 | v65.91,66.29 38.86,66.29 28.19,76.96 28.19,82.3 R9.1
B2  (via drill 0.61)
  Top 0.254: SELECT.1 4.57,62.1 10.67,62.1 SELECT.2 | v48.01,100.2 48.39,100.2 48.39,98.68 IC1.42
  Bottom 0.254: 25.15,82.68 24.38,82.68 R10.1 | 25.15,82.68 25.91,82.68 25.91,98.68 28.7,101.47 46.74,101.47 v48.01,100.2 | 25.15,82.68 25.15,74.3 23.62,72.77 18.29,72.77 18.29,69.34 11.05,62.1 SELECT.2
B3-PWM0  (via drill 0.61)
  Top 0.254: v48.77,96.77 47.62,96.77 47.62,98.3 IC1.43 | 72.39,78.87 v71.25,80.01 | 72.39,78.87 IC4.2 72.39,78.87 | 72.39,78.87 73.91,80.39 77.34,80.39 77.34,78.49 IC4.6
  Bottom 0.254: v48.77,96.77 53.72,91.82 56.01,91.82 67.82,80.01 v71.25,80.01
B4
  Top 0.254: IC1.44 46.86,98.68 46.86,105.92 51.82,105.92 54.1,108.2 LCD16X2.15
B5-MOSI  (via drill 0.6)
  Top 0.254: IC1.1 41.72,96.71 38.1,100.33 v36.83,100.33 | v31.75,100.33 30.48,101.6 15.24,101.6 JP1.4
  Bottom 0.254: v36.83,100.33 v31.75,100.33
B6-MISO  (via drill 0.61)
  Top 0.254: v37.72,96.77 38.48,96.01 44.96,96.01 IC1.2 | v27.05,97.92 17.91,97.92 JP1.1
  Bottom 0.254: v37.72,96.77 36.2,98.3 28.96,98.3 28.57,97.92 v27.05,97.92
B7-SCK  (via drill 0.61)
  Top 0.254: v37.72,95.25 44.96,95.25 IC1.3 | v30.1,97.16 30.1,100.2 17.91,100.2 JP1.3
  Bottom 0.254: v37.72,95.25 35.81,97.16 v30.1,97.16
C2  (via drill 0.6 pad 0.3, 0.61)  (2 unrouted)
  Top 0.254: v54.1,85.34 54.1,86.87 IC1.21 | v22.86,73.91 23.62,73.15 44.58,73.15 44.96,73.53 62.1,73.53 62.23,73.66 62.23,78.74 59.05,78.74 v58.42,78.1 | v24.64,106.55 26.29,108.2 LCD16X2.4
  Bottom 0.254: v22.86,73.91 22.86,80.77 22.1,81.53 22.1,98.3 26.67,102.87 26.67,104.52 v24.64,106.55 | v54.1,85.34 54.1,83.31 53.34,82.55 53.34,81.28 58.42,81.28 v58.42,78.1
C3  (via drill 0.61)
  Top 0.254: v77.34,76.2 79.63,76.2 79.63,85.34 77.72,87.25 73.91,87.25 73.15,86.49 55.25,86.49 54.86,86.87 IC1.22 | v39.24,72.01 38.86,72.39 22.86,72.39 v21.34,73.91 | v24.76,105.16 26.29,106.68 29.72,106.68 31.24,108.2 LCD16X2.6
  Bottom 0.254: v77.34,76.2 76.96,76.58 74.68,76.58 72.39,74.3 72.39,68.58 70.87,68.58 69.72,69.72 69.72,70.87 66.29,70.87 62.87,67.44 56.77,67.44 53.34,70.87 40.39,70.87 v39.24,72.01 | v21.34,73.91 21.34,78.87 19.05,81.15 19.05,105.41 24.51,105.41 v24.76,105.16
C4  (via drill 0.61)
  Top 0.254: v56.39,87.63 56.39,88.77 IC1.23 | v56.39,82.3 54.1,80.01 46.86,80.01 v46.48,80.39 | v40.77,84.58 40.77,89.92 v41.15,89.92 | v41.15,99.06 41.15,104.39 41.53,104.39 44.2,107.06 LCD16X2.11
  Bottom 0.254: v56.39,82.3 v56.39,87.63 | v46.48,80.39 46.48,81.53 43.43,84.58 v40.77,84.58 | v41.15,99.06 v41.15,89.92
C5  (via drill 0.61)
  Top 0.254: v54.86,89.53 56.39,89.53 IC1.24 | v52.2,82.3 51.05,81.15 v47.62,81.15 | v42.67,99.06 42.67,104.77 43.05,104.77 46.48,108.2 LCD16X2.12
  Bottom 0.254: v54.86,89.53 54.86,86.49 53.72,86.49 52.2,84.96 v52.2,82.3 | v47.62,81.15 47.62,77.34 43.05,77.34 40.39,80.01 39.62,80.01 37.34,82.3 37.34,85.72 38.48,85.72 42.67,89.92 v42.67,99.06
C6  (via drill 0.61)
  Top 0.254: v59.05,90.3 56.77,90.3 IC1.25 | v57.91,102.87 57.91,105.16 v56.77,105.16
  Bottom 0.254: v59.05,90.3 53.72,95.63 53.72,99.44 54.48,99.44 v57.91,102.87 | v56.77,105.16 56.01,105.92 53.34,105.92 52.58,106.68 51.05,106.68 49.53,108.2 LCD16X2.13
C7  (via drill 0.61)
  Top 0.254: v53.72,90.68 54.1,91.06 56.39,91.06 IC1.26 | v45.34,98.68 45.34,106.3 46.48,106.3 46.86,106.68 50.29,106.68 LCD16X2.14
  Bottom 0.254: v53.72,90.68 48.77,95.63 48.39,95.63 v45.34,98.68
D0-RX
  Top 0.254: IC1.9 44.96,90.3 44.2,90.3 41.91,88.01 41.91,82.68 39.62,82.68 R3.1
D1-TX
  Top 0.254: IC1.10 44.96,89.53 44.2,89.53 43.43,88.77 43.43,82.68 R2.1
D2  (via drill 0.61)
  Top 0.254: v38.48,83.82 38.1,83.82 38.1,82.3 38.86,81.53 44.2,81.53 44.2,83.82 44.96,84.58 44.96,88.77 IC1.11 | v44.58,78.49 44.96,78.1 v51.05,78.1 | v77.34,82.3 78.49,83.44 78.49,84.2 IC4.8
  Bottom 0.254: v38.48,83.82 38.48,83.44 38.1,83.06 38.1,82.3 39.62,80.77 41.91,80.77 44.2,78.49 v44.58,78.49 | v51.05,78.1 52.2,76.96 72.01,76.96 v77.34,82.3
D3  (via drill 0.61)
  Top 0.254: v47.24,85.34 46.86,85.34 46.86,86.87 IC1.12 | v45.34,79.63 45.72,79.25 70.1,79.25 70.87,78.49 IC4.1
  Bottom 0.254: v47.24,85.34 46.86,85.72 40.39,85.72 39.62,84.96 39.62,83.82 40.01,83.82 44.2,79.63 v45.34,79.63
D6  (via drill 0.61)
  Top 0.254: 10.67,72.39 4.57,72.39 RETRY.1 | v48.77,85.34 49.15,85.34 49.15,86.87 IC1.15 | v45.72,83.82 45.72,81.91 45.34,81.91 44.2,80.77 22.48,80.77 20.95,82.3 20.57,82.3 R11.1 20.19,82.3 17.53,79.63 10.67,79.63 10.67,72.39 | 10.67,72.39 RETRY.2
  Bottom 0.254: v48.77,85.34 47.24,83.82 v45.72,83.82
D7-PWM2
  Top 0.254: 72.39,84.96 71.63,85.72 57.53,85.72 56.01,84.2 46.86,84.2 46.1,84.96 46.1,88.01 49.91,88.01 49.91,87.25 IC1.16 | 72.39,84.96 IC4.13 72.39,84.96 | 72.39,84.96 73.91,86.49 77.34,86.49 77.34,84.58 IC4.9
GND  (via drill 0.61)
  Top 0.254: 37.34,109.73 JP2.9 | 37.34,109.73 30.48,109.73 | 30.48,109.73 29.34,108.58 LCD16X2.5 | 30.48,109.73 20.19,109.73 19.05,108.58 LCD16X2.1 18.54,107.95 16.51,107.95 15.24,106.68 JP1.6 | 37.34,109.73 55.63,109.73 56.77,108.58 LCD16X2.16 57.15,108.2 60.2,108.2 68.58,99.82 | 51.44,92.2 51.44,92.58 56.39,92.58 IC1.28 56.77,92.58 63.25,92.58 67.44,96.77 | 51.44,92.2 51.44,87.25 IC1.18 | 51.44,92.2 50.67,92.2 | 50.67,92.2 47.24,92.2 46.86,92.58 45.34,92.58 IC1.6 44.96,92.58 39.24,92.58 v38.86,92.96 | 50.67,92.2 50.67,98.3 IC1.39 | 67.44,96.77 70.87,96.77 IC2.18 71.25,96.77 79.63,96.77 | 65.53,98.68 64.77,99.44 64.01,99.44 IC2.7 | 67.44,96.77 65.53,98.68 | 65.53,98.68 67.44,98.68 | 67.44,98.68 70.87,98.68 IC2.21 | 67.44,98.68 68.58,99.82 | 68.58,99.82 70.1,101.35 70.87,101.35 IC2.25 | X1.M4 80.01,104.77 85.34,104.77 X1.M1 85.72,104.77 85.72,96.01 X1.M2 85.34,96.01 80.01,96.01 X1.M3 | 79.63,96.77 79.63,96.01 X1.M3 | 79.63,96.77 79.63,98.68 X1.1 | X1.M3 79.63,96.77 | SELECT.3 4.57,57.53 10.67,57.53 SELECT.4 | RETRY.3 4.57,67.82 10.67,67.82 RETRY.4 11.05,67.82 11.81,68.58 18.29,68.58 C3.- | DEC.3 91.06,57.53 97.16,57.53 DEC.4 | INC.4 97.16,67.82 91.06,67.82 INC.3 90.68,67.82 88.77,69.72 85.72,69.72 C4.- 85.34,69.72 83.06,67.44 58.29,67.44 | 48.01,67.44 48.01,60.96 | 48.01,67.44 47.62,67.44 RESET.3 | 42.67,67.82 47.24,67.82 RESET.3 | 42.67,67.82 5V.K | 48.01,67.44 53.72,67.44 RESET.4 54.1,67.44 58.29,67.44 | RESET.3 48.01,67.44 | 48.01,60.96 46.86,60.96 45.72,59.82 31.62,59.82 30.48,58.67 SVIN.5 | 48.01,60.96 R7.1 | 58.29,67.44 62.1,63.63 IC3.3 | 42.67,67.82 28.57,67.82 26.67,69.72 C5.-
  Bottom 0.254: SELECT.3 4.57,57.53 7.62,60.58 7.62,67.44 4.57,67.44 RETRY.3 | C3.- 20.57,70.87 25.53,70.87 26.29,70.1 C5.- 26.67,70.1 26.67,83.06 27.43,83.82 27.81,83.82 27.81,86.11 C2.1 28.19,86.49 37.34,86.49 37.34,87.63 38.86,89.15 v38.86,92.96 38.86,97.16 36.96,99.06 C1.2 | DEC.3 91.06,57.53 95.25,61.72 95.25,67.44 97.16,67.44 INC.4
GNDA
  Top 0.254: 12V.K 32.77,69.72 31.62,68.58 29.34,68.58 27.05,70.87 23.62,70.87 21.72,68.96 21.72,63.63 S12V.3 | S12V.2 19.05,63.63 21.34,63.63 S12V.3 | 25.91,60.58 23.24,63.25 21.72,63.25 S12V.3 | 25.91,60.58 27.81,58.67 SVIN.4 | 25.91,60.58 36.58,60.58 39.24,63.25 IC5.3 | 12V+.3 26.67,4.95 29.34,7.62 12V+.2 | Q7.S 26.67,39.62 21.72,44.58 15.24,44.58 14.1,43.43 D3.A | Q12.S 80.01,39.62 75.06,44.58 30.48,44.58 29.34,43.43 D4.A
  Bottom 0.254: 91.44,25.15 92.96,25.15 R22.1 | 91.44,25.15 83.44,25.15 82.68,24.38 R19.1 | 91.44,30.48 91.44,37.34 95.25,37.34 | 91.44,30.48 91.44,25.15 | 91.44,30.48 85.34,30.48 80.39,35.43 Q8.E | 12.57,25.15 18.29,25.15 19.05,24.38 R16.1 19.05,12.57 26.67,4.95 12V+.3 | 12.57,25.15 8.38,25.15 7.62,24.38 R13.1 | 12.57,25.15 12.57,35.43 11.81,35.43 Q2.E | SVIN.4 28.19,58.29 28.19,51.82 29.72,51.82 30.48,51.05 30.48,43.43 29.34,43.43 D4.A
  Bottom 1.016: D8.A 97.79,39.37 Q13.S 95.25,37.34 Q9.E | D7.A 82.55,39.37 Q12.S Q8.E | D4.A 29.21,39.37 Q7.S Q3.E | D3.A 13.97,39.37 Q6.S Q2.E
MOTOR1A
  Top 1.016: D3.C 1.27,43.18 1.27,21.59 26.67,21.59 MOTOR2.1
  Bottom 1.016: Q4.D 8.89,46.99 | 8.89,46.99 8.89,43.18 | 8.89,43.18 Q6.D | 8.89,46.99 D2.A D3.C 8.89,43.18
MOTOR1A1
  Top 1.016: D7.C 72.39,25.4 MOTOR1.1
  Bottom 1.016: Q10.D 77.47,46.99 | 77.47,46.99 77.47,43.18 | 77.47,43.18 Q12.D | 77.47,46.99 D6.A D7.C 77.47,43.18
MOTOR1B
  Top 1.016: D4.C 19.05,33.02 26.67,33.02 MOTOR2.3
  Bottom 1.016: Q5.D 24.13,46.99 | 24.13,46.99 24.13,43.18 | 24.13,43.18 Q7.D | 24.13,46.99 D5.A D4.C 24.13,43.18
MOTOR1B1
  Top 1.016: MOTOR1.3 74.93,33.02 87.63,33.02 D8.C
  Bottom 1.016: Q11.D 92.71,46.99 | 92.71,43.18 Q13.D | D8.C D9.A 92.71,46.99 | 92.71,43.18 88.9,43.18 | 92.71,46.99 92.71,43.18
N$1
  Top 0.254: IC1.7 44.96,91.82 36.58,91.82 33.15,95.25 Q1.1 32,95.25 28.19,91.44 C2.2
N$2
  Top 0.254: IC1.8 44.96,91.06 33.91,91.06 Q1.2
  Bottom 0.254: C1.1 31.62,90.3 32.77,90.3 Q1.2
N$3  (via drill 0.6 pad 0.3)
  Top 0.254: v56.52,78.1 57.79,76.83 61.6,76.83 61.6,75.56 v60.96,74.93 | v64.77,78.1 v64.77,74.93 | v64.77,81.91 64.77,83.19 v66.04,84.45 | v74.3,97.79 73.66,99.06 73.66,100.33 72.39,100.33 72.09,100.03 IC2.23
  Bottom 0.254: R5.1 50.8,80.01 52.07,78.74 55.88,78.74 v56.52,78.1 | v64.77,74.93 v60.96,74.93 | v64.77,81.91 v64.77,78.1 | v66.04,84.45 66.04,89.53 v74.3,97.79
N$4  (via drill 0.61)
  Top 0.254: v72.77,99.44 71.25,99.44 IC2.22 | R6.1 54.86,82.68 55.25,82.68 57.66,85.09 64.64,85.09 64.64,84.71 v64.77,84.58
  Bottom 0.254: v72.77,99.44 64.77,91.44 v64.77,84.58
N$5
  Bottom 0.254: TX.K 70.87,70.1 70.87,73.91 57.15,73.91 54.86,76.2 52.2,76.2 51.05,75.06 R5.2
N$6  (via drill 0.61)
  Top 0.254: v40.39,76.2 45.34,81.15 45.72,81.15 46.86,82.3 R4.1
  Bottom 0.254: v40.39,76.2 38.1,76.2 5V.A
N$7
  Bottom 0.254: RX.K 60.2,73.15 56.39,73.15 R6.2
N$8  (via drill 0.6 pad 0.3)
  Top 0.254: IC2.2 64.37,102.63 v67.31,99.69 | v74.93,73.66 73.66,73.66 69.85,77.47 v69.85,78.1 | v70.48,92.71 70.48,93.34 v67.94,95.88
  Bottom 0.254: v67.31,99.69 67.94,99.69 72.39,104.14 74.3,104.14 74.3,102.23 v67.94,95.88 | C6.+ 75.18,73.41 v74.93,73.66 | v69.85,78.1 70.48,78.1 73.66,81.28 73.66,89.53 v70.48,92.71
N$9  (via drill 0.6)
  Top 0.254: X1.4 77,101.13 76.2,100.33 76.2,97.79 v77.47,97.79 | IC2.16 74.69,95.48 v74.93,95.25
  Bottom 0.254: v77.47,97.79 v74.93,95.25
N$10  (via drill 0.61)
  Top 0.254: v76.96,99.06 76.96,100.2 79.25,100.2 X1.3 | 71.25,94.87 IC2.15 71.5,94.27 v71.5,93.6
  Bottom 0.254: v76.96,99.06 v71.5,93.6
N$11
  Bottom 0.254: R18.1 78.87,24.38 78.87,30.48 81.15,30.48 82.3,31.62 R19.2 80.39,33.91 76.58,33.91 Q8.C
  Bottom 1.016: Q10.G 69.85,50.8 69.85,39.37 Q12.G Q8.C
N$12
  Top 0.254: R21.1 90.3,24.38 90.3,30.48 92.58,30.48 93.73,31.62 R22.2 Q9.C
  Bottom 1.016: Q11.G 85.09,50.8 85.09,39.37 Q13.G Q9.C
N$13
  Bottom 0.254: R7.2 50.67,58.67 50.67,64.77 37.72,64.77 36.96,65.53 16.76,65.53 11.81,60.58 9.91,60.58 8.76,61.72 8.76,77.72 10.29,77.72 12.19,79.63 14.48,79.63 16.38,81.53 16.38,106.68 22.1,106.68 23.62,108.2 LCD16X2.3
N$14
  Top 0.254: Q9.B 92.96,35.43 96.77,31.62 96.77,24.38 97.54,24.38 R23.1
N$15  (via drill 0.61)
  Top 0.254: v83.06,34.29 82.68,33.91 79.25,33.91 77.72,35.43 Q8.B
  Bottom 0.254: v83.06,34.29 83.82,34.29 R20.2
N$16
  Top 0.254: Q6.G 6.48,39.24 6.48,35.81 Q2.C 6.48,35.43 6.48,32 7.62,32 R13.2
  Bottom 0.254: R12.1 3.81,30.48 6.48,30.48 7.62,31.62 R13.2
  Bottom 1.016: Q4.G 1.27,50.8 1.27,39.37 Q6.G
N$17
  Top 0.254: R15.1 15.24,27.43 19.05,31.24 R16.2
  Bottom 0.254: R16.2 19.05,35.43 21.34,35.43 Q3.C
  Bottom 1.016: Q5.G 16.51,50.8 16.51,39.37 Q7.G Q3.C
N$18  (via drill 0.61)
  Top 0.254: IC4.3 73.91,78.49 73.91,79.63 75.44,79.63 76.2,78.87 IC4.5 v76.2,72.77 | v76.2,59.05 70.48,53.34 12.57,53.34 12.57,42.67 13.33,41.91 16.76,41.91 16.76,29.72 11.43,24.38 R14.1
  Bottom 0.254: v76.2,72.77 v76.2,59.05
N$19  (via drill 0.61)
  Top 0.254: IC4.12 73.91,84.58 73.91,85.72 75.44,85.72 76.2,84.96 IC4.10 76.2,84.2 75.82,84.2 v75.82,82.3
  Bottom 0.254: v75.82,82.3 76.96,83.44 77.72,83.44 86.49,74.68 90.68,74.68 94.49,70.87 99.82,70.87 99.82,28.19 94.49,22.86 87.63,22.86 R20.1
N$20  (via drill 0.61)
  Top 0.254: v75.06,75.44 75.06,78.1 IC4.4 | v63.25,39.62 52.96,29.34 25.15,29.34 22.86,31.62 R17.2
  Bottom 0.254: v75.06,75.44 80.77,69.72 80.77,64.39 84.2,64.39 84.96,63.63 84.96,52.96 70.48,52.96 63.25,45.72 v63.25,39.62
N$21
  Top 0.254: JP6.1 81.15,57.15 75.06,63.25 75.06,64.77 69.72,64.77 68.58,63.63 S5V.1
N$22  (via drill 0.61)
  Top 0.254: v78.1,81.15 74.68,81.15 74.68,84.2 IC4.11
  Bottom 0.254: v78.1,81.15 88.77,70.48 88.77,53.72 96.39,53.72 99.06,51.05 99.06,32 97.92,32 R23.2
N$23
  Top 0.254: IC5.2 41.53,56.01 40.39,54.86 25.15,54.86 S12V.6
N$24
  Bottom 0.254: R17.1 22.86,30.48 23.24,30.48 24,31.24 24,35.43 Q3.B
N$25
  Top 0.254: Q2.B 9.14,35.43 9.14,32 11.43,32 R14.2
N$26
  Top 0.254: IC3.2 64.77,56.39 65.53,57.15 72.39,57.15 S5V.6 73.91,58.67 73.91,63.25 S5V.3
N$27
  Bottom 0.254: JP6.2 81.91,55.24 71.63,55.24 68.58,58.29 S5V.4
N$28
  Top 0.254: VIN.3 77.72,4.95 80.39,7.62 VIN.2
  Bottom 0.254: SVIN.6 34.29,57.15 36.2,57.15 81.91,11.43 81.91,7.62 VIN.2
N$29
  Top 0.254: JP4.1 81.15,62.48 78.1,65.53 68.58,65.53 65.53,62.48 65.53,59.44 46.1,59.44 44.2,57.53 33.91,57.53 33.53,57.15 24.76,57.15 22.1,59.82 17.91,59.82 S12V.4
N$30
  Bottom 0.254: JP4.2 83.82,62.1 79.63,57.91 75.82,57.91 75.06,58.67 75.06,59.82 53.72,59.82 51.44,57.53 44.2,57.53 36.96,64.77 17.91,64.77 16.76,63.63 S12V.1
N$31  (via drill 0.61)
  Top 0.254: v43.05,56.39 59.82,56.39 IC3.1
  Bottom 0.254: v43.05,56.39 42.67,56.77 37.72,56.77 31.24,63.25 30.48,63.25 SVIN.2
N$32  (via drill 0.61)
  Top 0.254: 12V.A 30.48,70.1 31.24,70.87 56.01,70.87 57.53,72.39 63.5,72.39 63.5,78.1 v63.25,78.1
  Bottom 0.254: v63.25,78.1 59.05,82.3 58.67,82.3 R24.1
N$33  (1 unrouted)
N$34  (via drill 3.05 pad 5.08)
  other vias: 25.4,113.03
N$35  (via drill 3.05 pad 5.08)
  other vias: 76.2,113.03
N$36  (via drill 3.05 pad 5.08)
  other vias: 5.08,3.81
N$37  (via drill 3.05 pad 5.08)
  other vias: 96.52,3.81
N$38  (via drill 3.05 pad 5.08)
  other vias: 38.1,3.81
N$39  (via drill 3.05 pad 5.08)
  other vias: 66.04,3.81
RESET  (via drill 0.6, 0.61)
  Top 0.254: v57.53,68.58 75.82,68.58 76.96,69.72 C6.- | RESET.1 47.62,72.39 53.72,72.39 RESET.2 | v40.01,94.11 44.96,94.11 IC1.4 | 38.48,87.25 35.81,84.58 35.81,82.68 R1.1 | 38.48,87.25 v39.62,88.39 | 38.48,87.25 36.96,88.77 16.38,88.77 16.38,98.93 16.51,99.06 v20.32,99.06 | v20.32,102.87 JP1.5
  Bottom 0.254: v57.53,68.58 54.1,72.01 RESET.2 | v40.01,94.11 40.01,88.39 v39.62,88.39 | RESET.1 47.24,72.39 40.39,79.25 38.86,79.25 R1.1 | v20.32,99.06 v20.32,102.87
RX  (via drill 0.61)
  Top 0.254: v59.82,107.06 63.63,103.25 IC2.1 | v51.44,110.87 v43.05,110.87 | v40.39,106.68 31.24,97.54 31.24,95.25 v17.91,95.25 | v19.05,79.63 22.48,76.2 38.1,76.2 R3.2
  Bottom 0.254: v59.82,107.06 56.01,110.87 v51.44,110.87 | v43.05,110.87 41.91,109.73 41.15,109.73 40.39,108.97 v40.39,106.68 | v17.91,95.25 17.91,79.63 v19.05,79.63
TX  (via drill 0.61)
  Top 0.254: v60.96,100.58 63.63,100.58 IC2.5 | v53.72,104.77 52.96,104.01 48.77,104.01 v48.01,103.25 | v24,84.58 27.05,81.53 33.53,81.53 v33.91,81.91
  Bottom 0.254: v60.96,100.58 60.96,104.01 54.86,104.01 54.1,104.77 v53.72,104.77 | v48.01,103.25 47.62,102.87 28.57,102.87 23.62,97.92 23.62,84.58 v24,84.58 | v33.91,81.91 38.48,77.34 40.77,77.34 R2.2
V+  (via drill 0.61)
  Top 0.254: v76.96,29.34 76.96,11.05 77.34,11.05 VIN.1
  Bottom 0.254: v76.96,29.34 71.63,29.34 43.43,57.53 38.86,57.53 33.15,63.25 SVIN.3
VCCIO  (via drill 0.61)
  Top 0.254: v35.81,56.01 36.96,56.01 IC5.1
  Bottom 0.254: v35.81,56.01 35.81,11.05 26.67,11.05 12V+.1